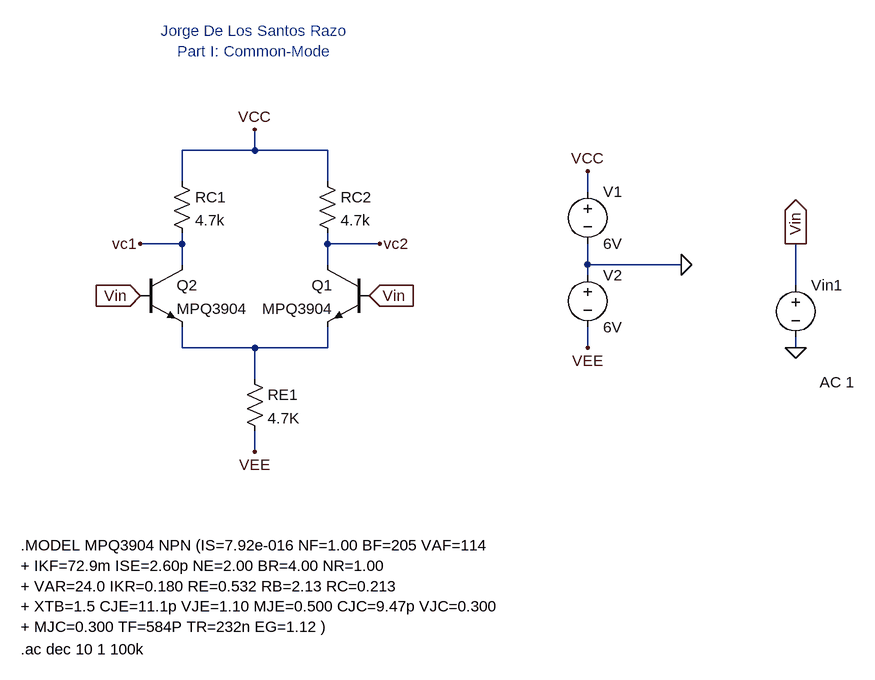
[diagram p0: schematic Common-Mode.asc]
Common-Mode.asc, the LTspice schematic file:
Version 4.1
SHEET 1 1292 736
WIRE 368 -48 368 -80
WIRE 368 -48 256 -48
WIRE 480 -48 368 -48
WIRE 256 0 256 -48
WIRE 480 0 480 -48
WIRE 880 16 880 -16
WIRE 256 96 256 80
WIRE 256 96 192 96
WIRE 480 96 480 80
WIRE 560 96 480 96
WIRE 256 128 256 96
WIRE 480 128 480 96
WIRE 880 128 880 96
WIRE 1024 128 880 128
WIRE 880 144 880 128
WIRE 1200 160 1200 96
WIRE 256 256 256 224
WIRE 368 256 256 256
WIRE 480 256 480 224
WIRE 480 256 368 256
WIRE 880 256 880 224
WIRE 1200 256 1200 240
WIRE 368 304 368 256
WIRE 368 416 368 384
FLAG 1200 256 0
FLAG 368 416 VEE
FLAG 368 -80 VCC
FLAG 880 256 VEE
FLAG 880 -16 VCC
FLAG 1024 128 0
FLAG 192 96 vc1
FLAG 560 96 vc2
FLAG 1200 96 Vin
IOPIN 1200 96 Out
FLAG 544 176 Vin
IOPIN 544 176 In
FLAG 192 176 Vin
IOPIN 192 176 In
SYMBOL npn 544 128 M0
SYMATTR InstName Q1
SYMATTR Value MPQ3904
SYMBOL npn 192 128 R0
SYMATTR InstName Q2
SYMATTR Value MPQ3904
SYMBOL res 240 -16 R0
SYMATTR InstName RC1
SYMATTR Value 4.7k
SYMBOL res 464 -16 R0
SYMATTR InstName RC2
SYMATTR Value 4.7k
SYMBOL res 352 288 R0
SYMATTR InstName RE1
SYMATTR Value 4.7K
SYMBOL voltage 1200 144 R0
WINDOW 3 37 137 Left 2
WINDOW 123 37 165 Left 2
WINDOW 39 0 0 Left 0
SYMATTR Value ""
SYMATTR Value2 AC 1
SYMATTR InstName Vin1
SYMBOL voltage 880 0 R0
SYMATTR InstName V1
SYMATTR Value 6V
SYMBOL voltage 880 128 R0
SYMATTR InstName V2
SYMATTR Value 6V
TEXT 8 560 Left 2 !.MODEL MPQ3904 NPN (IS=7.92e-016 NF=1.00 BF=205 VAF=114\n+ IKF=72.9m ISE=2.60p NE=2.00 BR=4.00 NR=1.00\n+ VAR=24.0 IKR=0.180 RE=0.532 RB=2.13 RC=0.213\n+ XTB=1.5 CJE=11.1p VJE=1.10 MJE=0.500 CJC=9.47p VJC=0.300\n+ MJC=0.300 TF=584P TR=232n EG=1.12 )
TEXT 368 -216 Center 2 ;Jorge De Los Santos Razo\nPart I: Common-Mode
TEXT 8 720 Left 2 !.ac dec 10 1 100k

The netlist it stands for:
* Common-Mode.asc
Q1 vc2 Vin N001 0 MPQ3904
Q2 vc1 Vin N001 0 MPQ3904
RC1 VCC vc1 4.7k
RC2 VCC vc2 4.7k
RE1 N001 VEE 4.7K
Vin1 Vin 0 AC 1
V1 VCC 0 6V
V2 0 VEE 6V
.model NPN NPN
.model PNP PNP
.lib standard.bjt
.MODEL MPQ3904 NPN (IS=7.92e-016 NF=1.00 BF=205 VAF=114
+ IKF=72.9m ISE=2.60p NE=2.00 BR=4.00 NR=1.00
+ VAR=24.0 IKR=0.180 RE=0.532 RB=2.13 RC=0.213
+ XTB=1.5 CJE=11.1p VJE=1.10 MJE=0.500 CJC=9.47p VJC=0.300
+ MJC=0.300 TF=584P TR=232n EG=1.12 )
* Jorge De Los Santos Razo
* Part I: Common-Mode
.ac dec 10 1 100k
.backanno
.end